# Altium schematic sheet UART_bus.SchDoc
size A4; SheetNumber: 5; SheetTotal: 10
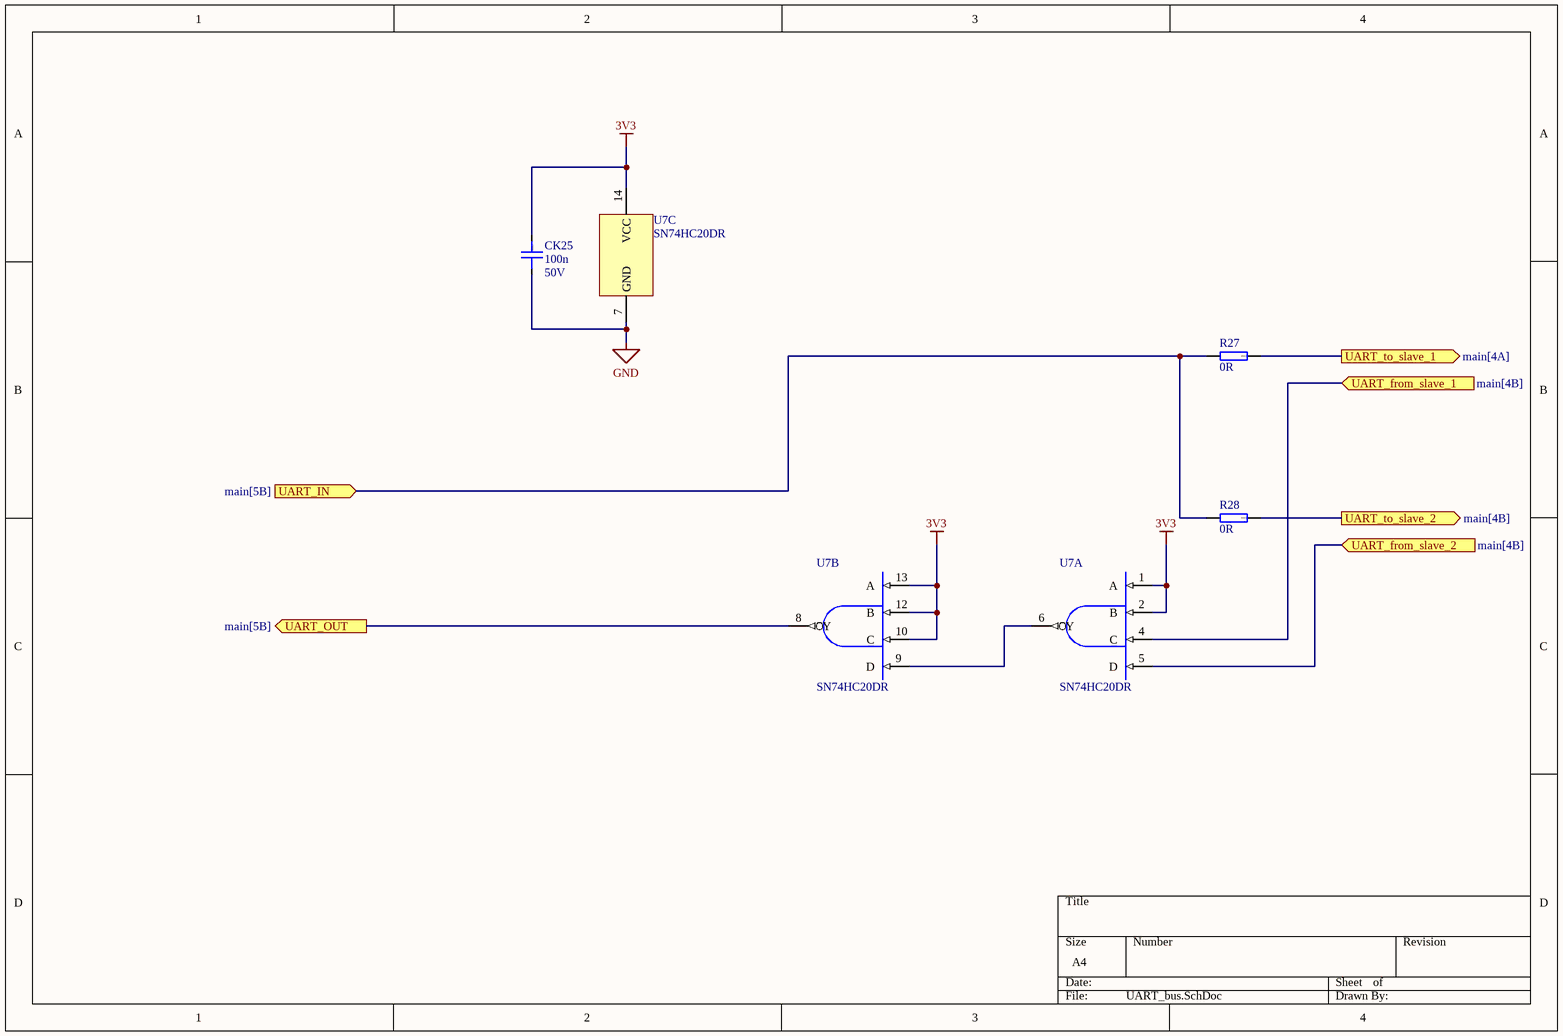
[diagram p0: UART_bus.SchDoc]

## Parts
CK25  100n  Voltage rating: 50V  [CAP0603]
R27  0R  [RESC2012X06N(SMR0805)]
R28  0R  [RESC2012X06N(SMR0805)]
U7  SN74HC20DR  [SOIC14]  (parts A,B,C of 3)

## Ports
UART_from_slave_1 (in, see main[4B]), UART_from_slave_2 (in, see main[4B]), UART_IN (in, see main[5B]), UART_OUT (out, see main[5B]), UART_to_slave_1 (out, see main[4A]), UART_to_slave_2 (out, see main[4B])

## Nets
3V3: CK25.1 U7.1(A) U7.2(B) U7.10(C) U7.12(B) U7.13(A) U7.14(VCC)
GND: CK25.2 U7.7(GND)
UART_from_slave_1: U7.4(C) ; port UART_from_slave_1
UART_from_slave_2: U7.5(D) ; port UART_from_slave_2
UART_IN: R27.1 R28.1 ; port UART_IN
UART_OUT: U7.8(Y) ; port UART_OUT
UART_to_slave_1: R27.2 ; port UART_to_slave_1
UART_to_slave_2: R28.2 ; port UART_to_slave_2
NetU7_6: U7.6(Y) U7.9(D)

## Notes on the sheet
- (in symbol Cap 100n 0603) 0603

## Library data of the parts
CK25 = Cap 100n 0603: 50V 100nF X7R ±10% 0603 Multilayer Ceramic Capacitors MLCC - SMD/SMT ROHS; Basic: Yes; Value: 100n; JLCPCB Part: C14663
R27 R28 = Res 0R 0805: 125mW Thick Film Resistors 150V ±800ppm/℃ ±1% 0Ω 0805 Chip Resistor - Surface Mount ROHS; Tolerance & Rating: 1%/0.1W; Basic: YES; Value: 0R; Package: 0805; Author: JP/27.03.2014; SMD: 1; ComponentLink3Description: rezistor čip; ComponentLink3URL: heliosgreen://v1/hegMT/5-MT/Classes(343)/Folders/OpenForm?RecordNumbers=[381513]; JLCPCB Part: C17477
U7 = SN74HC20DR: 2V~6V 2uA 2 19ns@6V,50pF NAND Gates SOIC-14 Logic Gates ROHS; Basic: No; JLCPCB Part: C2867684; TME Part: SN74HC20DR